# EAGLE design timelapse (EAGLE 8.6.0)
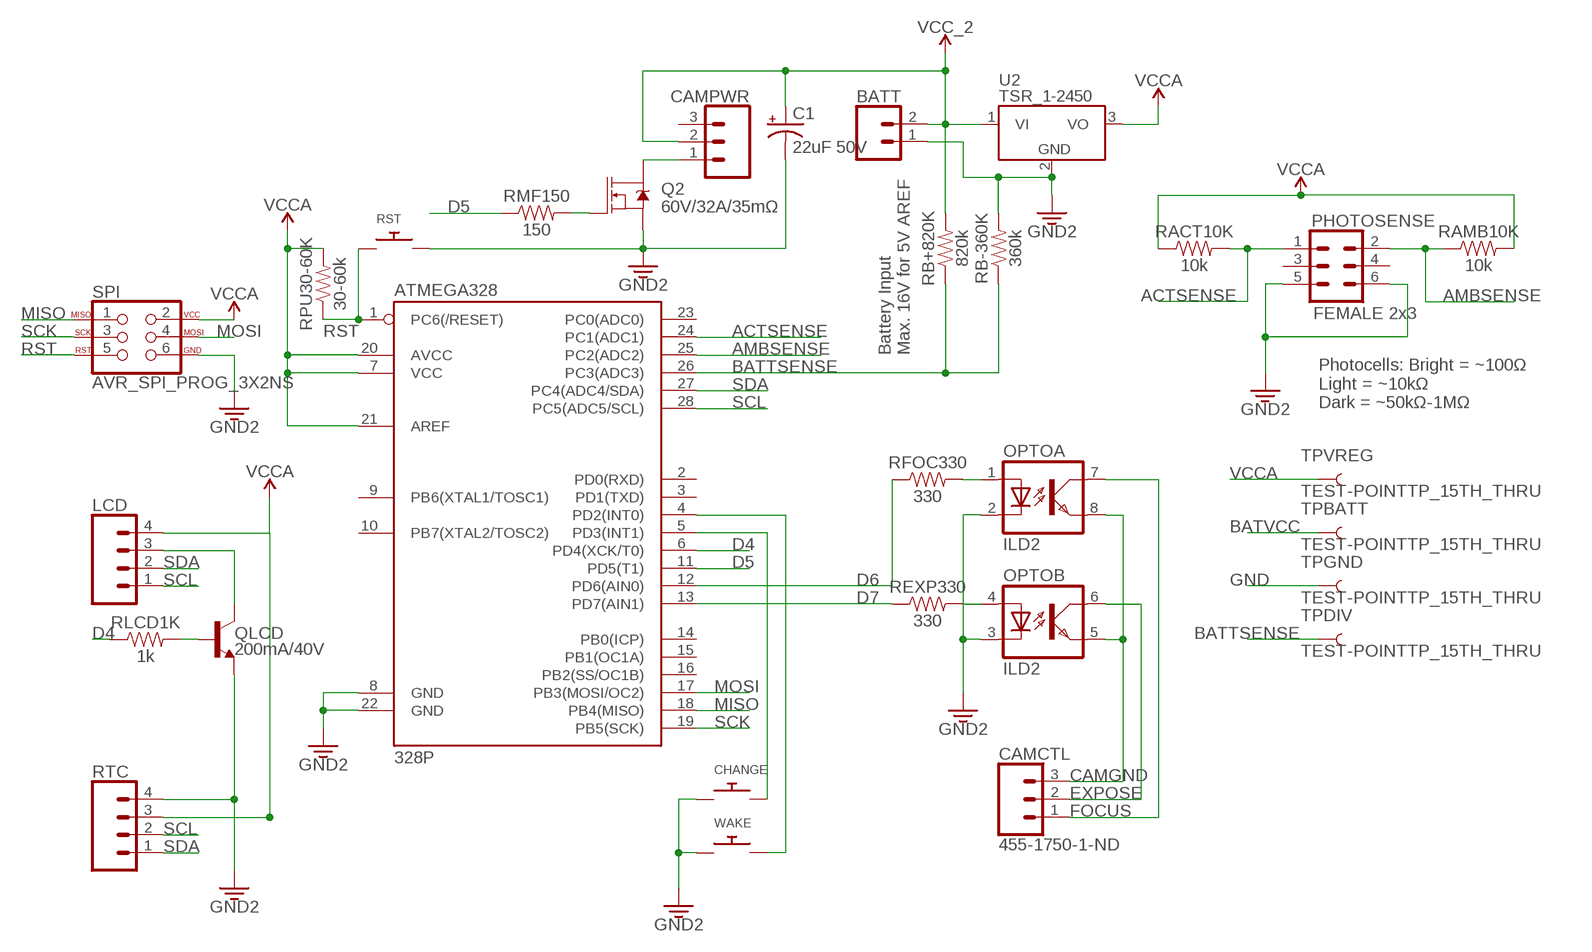
[diagram p0: schematic, sheet 1]

## Parts
ATMEGA328  328P  ATMEGA328P_PDIP  [DIP28]
BATT  CONN_02  [1X02]
C1  22uF 50V  10UF-POLAR-RADIAL-2.5MM-25V-20%  [CPOL-RADIAL-2.5MM-5MM]
CAMCTL  455-1750-1-ND  CONN_03  [1X03]
CAMPWR  CONN_03  [1X03]
CHANGE  SWITCH_PUSHBUTTONEVQ-PE  [TACT_PANA-EVQ]
LCD  CONN_04  [1X04]
OPTO  ILD2  [DIL08]
PHOTOSENSE  FEMALE 2x3  CONN_03X2FEMALE  [2X3]
Q2  60V/32A/35mΩ  MOSFET-NCH-FQP30N06L  [TO220V]
QLCD  200mA/40V  TRANS_NPN-2N3904  [TO-92]
RACT10K  10k  10KOHM-HORIZ-1/4W-1%  [AXIAL-0.3]
RAMB10K  10k  10KOHM-HORIZ-1/4W-1%  [AXIAL-0.3]
RB+820K  820k  10KOHM-HORIZ-1/4W-1%  [AXIAL-0.3]
RB-360K  360k  10KOHM-HORIZ-1/4W-1%  [AXIAL-0.3]
REXP330  330  330OHM-HORIZ-1/10W-5%  [AXIAL-0.3]
RFOC330  330  330OHM-HORIZ-1/10W-5%  [AXIAL-0.3]
RLCD1K  1k  330OHM-HORIZ-1/10W-5%  [AXIAL-0.3]
RMF150  150  330OHM-HORIZ-1/10W-5%  [AXIAL-0.3]
RPU30-60K  30-60k  330OHM-HORIZ-1/10W-5%  [AXIAL-0.3]
RST  SWITCH_PUSHBUTTONEVQ-PE  [TACT_PANA-EVQ]
RTC  CONN_04  [1X04]
SPI  AVR_SPI_PROG_3X2NS  [2X3-NS]
TPBATT  TEST-POINTTP_15TH_THRU  [TP_15TH]
TPDIV  TEST-POINTTP_15TH_THRU  [TP_15TH]
TPGND  TEST-POINTTP_15TH_THRU  [TP_15TH]
TPVREG  TEST-POINTTP_15TH_THRU  [TP_15TH]
U2  TSR_1-2450  [TSR-1]
WAKE  SWITCH_PUSHBUTTONEVQ-PE  [TACT_PANA-EVQ]

## Nets
ACTSENSE: ATMEGA328.24(PC1(ADC1)) PHOTOSENSE.1 RACT10K.P$2
AMBSENSE: ATMEGA328.25(PC2(ADC2)) PHOTOSENSE.2 RAMB10K.P$1
BATTSENSE: ATMEGA328.26(PC3(ADC3)) RB+820K.P$1 RB-360K.P$1 TPDIV.P$1
BATVCC [power]: BATT.2 C1.1(+) CAMPWR.2 RB+820K.P$2 TPBATT.P$1 U2.1(VI) ; supply symbol labelled VCC_2
CAMGND: CAMCTL.3 OPTO.5(B:EMIT) OPTO.8(A:EMIT)
D4: ATMEGA328.6(PD4(XCK/T0)) RLCD1K.P$1
D5: ATMEGA328.11(PD5(T1)) RMF150.P$1
D6: ATMEGA328.12(PD6(AIN0)) RFOC330.P$1
D7: ATMEGA328.13(PD7(AIN1)) REXP330.P$1
EXPOSE: CAMCTL.2 OPTO.6(B:COL)
FOCUS: CAMCTL.1 OPTO.7(A:COL)
GND [power]: ATMEGA328.8(GND) ATMEGA328.22(GND) BATT.1 C1.2(-) CHANGE.P$1 OPTO.2(A:C) OPTO.3(B:C) PHOTOSENSE.5 PHOTOSENSE.6 Q2.3(S) QLCD.1(E) RB-360K.P$2 RST.P$2 RTC.4 SPI.6 TPGND.P$1 U2.2(GND) WAKE.P$1 ; supply symbol labelled GND2
MISO: ATMEGA328.18(PB4(MISO)) SPI.1
MOSI: ATMEGA328.17(PB3(MOSI/OC2)) SPI.4
N$1: OPTO.1(A:A) RFOC330.P$2
N$2: OPTO.4(B:A) REXP330.P$2
N$3: QLCD.2(B) RLCD1K.P$2
N$5 [power]: LCD.3 QLCD.3(C)
N$6: Q2.1(G) RMF150.P$2
N$7: ATMEGA328.5(PD3(INT1)) CHANGE.P$2
N$8: ATMEGA328.4(PD2(INT0)) WAKE.P$2
N$9 [power]: CAMPWR.1 Q2.2(D)
RST: ATMEGA328.1(PC6(/RESET)) RPU30-60K.P$1 RST.P$1 SPI.5
SCK: ATMEGA328.19(PB5(SCK)) SPI.3
SCL: ATMEGA328.28(PC5(ADC5/SCL)) LCD.1 RTC.2
SDA: ATMEGA328.27(PC4(ADC4/SDA)) LCD.2 RTC.1
VCCA [power]: ATMEGA328.7(VCC) ATMEGA328.20(AVCC) ATMEGA328.21(AREF) LCD.4 RACT10K.P$1 RAMB10K.P$2 RPU30-60K.P$2 RTC.3 SPI.2 TPVREG.P$1 U2.3(VO)
Unconnected: ATMEGA328.2(PD0(RXD)) ATMEGA328.3(PD1(TXD)) ATMEGA328.9(PB6(XTAL1/TOSC1)) ATMEGA328.10(PB7(XTAL2/TOSC2)) ATMEGA328.14(PB0(ICP)) ATMEGA328.15(PB1(OC1A)) ATMEGA328.16(PB2(SS/OC1B)) ATMEGA328.23(PC0(ADC0)) CAMPWR.3 PHOTOSENSE.3 PHOTOSENSE.4

## Notes on the sheet
- Battery Input
  Max. 16V for 5V AREF
- Photocells: Bright = ~100Ω
  Light = ~10kΩ
  Dark = ~50kΩ-1MΩ

## Library data of the parts
ATMEGA328 = SparkFun-IC-Microcontroller:ATMEGA328P_PDIP: Atmel 328P Through hole ATMEGA328P uC used in the Arduino 32kb flash, 1k EEPROM, 2k SRAM Datasheet <http://www.sparkfun.com/datasheets/Components/SMD/ATMega328.pdf> SparkFun Products Storefront component: AVR 28 Pin 20MHz 32K 6A/D - ATMega328P <https://www.sparkfun.com/products/9061> (COM-09061) SparkFun Simon Says - Through-Hole Soldering Kit <https://www.sparkfun.com/products/10547> (KIT-10547) SparkFun Learn to Solder - Simon Says <https://www.sparkfun.com/products/13708> (KIT-13708) SparkFun BigTime Watch Kit <https://www.sparkfun.com/products/11734> (KIT-11734) SparkFun ClockIt <https://www.sparkfun.com/products/10930> (KIT-10930) SparkFun Serial Enabled LCD Kit <https://www.sparkfun.com/products/10097> (LCD-10097) SparkFun Simon Tilts - Through Hole Soldering Kit <https://www.sparkfun.com/products/12634> (KIT-12634) SparkFun Frequency Counter Kit <https://www.sparkfun.com/products/10140> (KIT-10140) FabFM Radio Kit <https://www.sparkfun.com/products/11043> (KIT-11043) SparkFun Binary Blaster Kit <https://www.sparkfun.com/products/12037> (KIT-12037) SparkFun Metro-Gnome <https://www.sparkfun.com/products/9236> (KIT-09236) ATmega328 with Arduino Optiboot (Uno) <https://www.sparkfun.com/products/10524> (DEV-10524); PROD_ID: IC-09136
BATT = SparkFun-Connectors:CONN_02: Multi connection point. Often used as Generic Header-pin footprint for 0.1 inch spaced/style header connections On any of the 0.1 inch spaced packages, you can populate with these: Break Away Headers - Straight <https://www.sparkfun.com/products/116> (PRT-00116) Break Away Male Headers - Right Angle <https://www.sparkfun.com/products/553> (PRT-00553) Female Headers <https://www.sparkfun.com/products/115> (PRT-00115) Break Away Headers - Machine Pin <https://www.sparkfun.com/products/117> (PRT-00117) Break Away Female Headers - Swiss Machine Pin <https://www.sparkfun.com/products/743> (PRT-00743) For SCREWTERMINALS and SPRING TERMINALS visit here: Screw Terimnals on SparkFun.com <https://www.sparkfun.com/search/results?term=Screw+Terminals> (5mm/3.5mm/2.54mm spacing) This device is also useful as a general connection point to wire up your design to another part of your project. Our various solder wires solder well into these plated through hole pads. Hook-Up Wire - Assortment (Stranded, 22 AWG) <https://www.sparkfun.com/products/11375> (PRT-11375) Hook-Up Wire - Assortment (Solid Core, 22 AWG) <https://www.sparkfun.com/products/11367> (PRT-11367) View the entire wire category on our website here <https://www.sparkfun.com/categories/141> Special notes: Molex polarized connector foot print use with: PRT-08233 with associated crimp pins and housings. 2.54_SCREWTERM for use with PRT-10571. 3.5mm Screw Terminal footprints for PRT-08084 5mm Screw Terminal footprints for use with PRT-08432
C1 = SparkFun-Capacitors:10UF-POLAR: 10.0µF polarized capacitors A capacitor is a passive two-terminal electrical component used to store electrical energy temporarily in an electric field.; PROD_ID: CAP-08440; VALUE: 10uF
CAMCTL = SparkFun-Connectors:CONN_03: Multi connection point. Often used as Generic Header-pin footprint for 0.1 inch spaced/style header connections On any of the 0.1 inch spaced packages, you can populate with these: Break Away Headers - Straight <https://www.sparkfun.com/products/116> (PRT-00116) Break Away Male Headers - Right Angle <https://www.sparkfun.com/products/553> (PRT-00553) Female Headers <https://www.sparkfun.com/products/115> (PRT-00115) Break Away Headers - Machine Pin <https://www.sparkfun.com/products/117> (PRT-00117) Break Away Female Headers - Swiss Machine Pin <https://www.sparkfun.com/products/743> (PRT-00743) Stackable Header - 3 Pin (Female, 0.1") <https://www.sparkfun.com/products/13875> (PRT-13875) For SCREWTERMINALS and SPRING TERMINALS visit here: Screw Terimnals on SparkFun.com <https://www.sparkfun.com/search/results?term=Screw+Terminals> (5mm/3.5mm/2.54mm spacing) This device is also useful as a general connection point to wire up your design to another part of your project. Our various solder wires solder well into these plated through hole pads. Hook-Up Wire - Assortment (Stranded, 22 AWG) <https://www.sparkfun.com/products/11375> (PRT-11375) Hook-Up Wire - Assortment (Solid Core, 22 AWG) <https://www.sparkfun.com/products/11367> (PRT-11367) View the entire wire category on our website here <https://www.sparkfun.com/categories/141> Special notes: Molex polarized connector foot print use with SKU : PRT-08232 with associated crimp pins and housings.; PROD_ID: XXX-00000
CAMPWR = SparkFun-Connectors:CONN_03: Multi connection point. Often used as Generic Header-pin footprint for 0.1 inch spaced/style header connections On any of the 0.1 inch spaced packages, you can populate with these: Break Away Headers - Straight <https://www.sparkfun.com/products/116> (PRT-00116) Break Away Male Headers - Right Angle <https://www.sparkfun.com/products/553> (PRT-00553) Female Headers <https://www.sparkfun.com/products/115> (PRT-00115) Break Away Headers - Machine Pin <https://www.sparkfun.com/products/117> (PRT-00117) Break Away Female Headers - Swiss Machine Pin <https://www.sparkfun.com/products/743> (PRT-00743) Stackable Header - 3 Pin (Female, 0.1") <https://www.sparkfun.com/products/13875> (PRT-13875) For SCREWTERMINALS and SPRING TERMINALS visit here: Screw Terimnals on SparkFun.com <https://www.sparkfun.com/search/results?term=Screw+Terminals> (5mm/3.5mm/2.54mm spacing) This device is also useful as a general connection point to wire up your design to another part of your project. Our various solder wires solder well into these plated through hole pads. Hook-Up Wire - Assortment (Stranded, 22 AWG) <https://www.sparkfun.com/products/11375> (PRT-11375) Hook-Up Wire - Assortment (Solid Core, 22 AWG) <https://www.sparkfun.com/products/11367> (PRT-11367) View the entire wire category on our website here <https://www.sparkfun.com/categories/141> Special notes: Molex polarized connector foot print use with SKU : PRT-08232 with associated crimp pins and housings.; PROD_ID: XXX-00000; VALUE: 455-1750-1-ND
CHANGE RST WAKE = adafruit:SWITCH_PUSHBUTTON: Buttons SOFTTOUCHSMD_SJ - Soft touch temporary push button (Super Junk Akihabara) Compatible with SKPMANE010 [Mouser: 688-SKPMAN] C&K_KSS = Digikey: KSS221GLFS
LCD RTC = SparkFun-Connectors:CONN_04: Multi connection point. Often used as Generic Header-pin footprint for 0.1 inch spaced/style header connections On any of the 0.1 inch spaced packages, you can populate with these: Break Away Headers - Straight <https://www.sparkfun.com/products/116> (PRT-00116) Break Away Male Headers - Right Angle <https://www.sparkfun.com/products/553> (PRT-00553) Female Headers <https://www.sparkfun.com/products/115> (PRT-00115) Break Away Headers - Machine Pin <https://www.sparkfun.com/products/117> (PRT-00117) Break Away Female Headers - Swiss Machine Pin <https://www.sparkfun.com/products/743> (PRT-00743) For SCREWTERMINALS and SPRING TERMINALS visit here: Screw Terimnals on SparkFun.com <https://www.sparkfun.com/search/results?term=Screw+Terminals> (5mm/3.5mm/2.54mm spacing) This device is also useful as a general connection point to wire up your design to another part of your project. Our various solder wires solder well into these plated through hole pads. Hook-Up Wire - Assortment (Stranded, 22 AWG) <https://www.sparkfun.com/products/11375> (PRT-11375) Hook-Up Wire - Assortment (Solid Core, 22 AWG) <https://www.sparkfun.com/products/11367> (PRT-11367) View the entire wire category on our website here <https://www.sparkfun.com/categories/141> Special notes: Molex polarized connector foot print use with SKU : PRT-08231 with associated crimp pins and housings. 1MM SMD Version SKU: PRT-10208; PROD_ID: CONN-09696
OPTO = optocoupler-2:ILD2: SIEMENS OPTO COUPLER
PHOTOSENSE = SparkFun-Connectors:CONN_03X2: Multi connection point. Often used as Generic Header-pin footprint for 0.1 inch spaced/style header connections You can populate with any combo of single row headers, but if you'd like an exact match, check these: Header - 2x3 (Male, 0.1") <https://www.sparkfun.com/products/12807> (PRT-12807) Header - 2x3 (Female, 0.1") <https://www.sparkfun.com/products/13010> (PRT-13010) 2x3 Pin Shrouded Header <https://www.sparkfun.com/products/10877> (PRT-10877) On any of the 0.1 inch spaced packages, you can populate with these: Break Away Headers - Straight <https://www.sparkfun.com/products/116> (PRT-00116) Break Away Male Headers - Right Angle <https://www.sparkfun.com/products/553> (PRT-00553) Female Headers <https://www.sparkfun.com/products/115> (PRT-00115) Break Away Headers - Machine Pin <https://www.sparkfun.com/products/117> (PRT-00117) Break Away Female Headers - Swiss Machine Pin <https://www.sparkfun.com/products/743> (PRT-00743) Special note: the shrouded connector mates well with our 3x2 ribbon cables: Ribbon Crimp Connector - 6-pin (2x3, Female) <https://www.sparkfun.com/products/10651> (PRT-10651) Ribbon Cable - 6 wire (15ft) <https://www.sparkfun.com/products/10646> (PRT-10646); PROD_ID: CONN-11566
Q2 = SparkFun-DiscreteSemi:MOSFET-NCH: N-channel MOSFETs Voltage controlled devices that allow control of high current outputs. SparkFun Products: SparkFun OpenScale <https://www.sparkfun.com/products/13261> SparkFun Digital Sandbox <https://www.sparkfun.com/products/12651> SparkFun Monster Moto Shield <https://www.sparkfun.com/products/10182> SparkFun MOSFET Power Controller <https://www.sparkfun.com/products/11214>; PROD_ID: TRANS-10060
QLCD = SparkFun-DiscreteSemi:TRANS_NPN: NPN transistor Current controlled devices typically used to amplify current or used as a switch. BC547 - COM-08928 <http://www.sparkfun.com/products/8928> (TO-92 45V 100mA) (1.Collector 2.Base 3.Emitter) 2N3904 - COM-00521 <http://www.sparkfun.com/products/521> (TO-92 40V 200mA) (1.Emitter 2.Base 3.Collector) P2N2222A - COM-12852 <http://www.sparkfun.com/products/12852> (TO-92 40V 600mA) (1.Collector 2.Base 3.Emitter); PROD_ID: TRANS-08447
RACT10K RAMB10K = SparkFun-Resistors:10KOHM: 10kΩ resistor A resistor is a passive two-terminal electrical component that implements electrical resistance as a circuit element. Resistors act to reduce current flow, and, at the same time, act to lower voltage levels within circuits. - Wikipedia; PROD_ID: RES-12183
RB+820K RB-360K = SparkFun-Resistors:10KOHM: 10kΩ resistor A resistor is a passive two-terminal electrical component that implements electrical resistance as a circuit element. Resistors act to reduce current flow, and, at the same time, act to lower voltage levels within circuits. - Wikipedia; PROD_ID: RES-12183; VALUE: 10k
REXP330 RFOC330 = SparkFun-Resistors:330OHM: 330Ω resistor A resistor is a passive two-terminal electrical component that implements electrical resistance as a circuit element. Resistors act to reduce current flow, and, at the same time, act to lower voltage levels within circuits. - Wikipedia; PROD_ID: RES-8371
RLCD1K RMF150 RPU30-60K = SparkFun-Resistors:330OHM: 330Ω resistor A resistor is a passive two-terminal electrical component that implements electrical resistance as a circuit element. Resistors act to reduce current flow, and, at the same time, act to lower voltage levels within circuits. - Wikipedia; PROD_ID: RES-8371; VALUE: 330
SPI = SparkFun-Connectors:AVR_SPI_PROG_3X2: AVR ISP 6 Pin This is the reduced ISP connector for AVR programming. Common on Arduino. This footprint will take up less PCB space and can be used with a 10-pin to 6-pin adapter such as SKU: BOB-08508 **Special note about "TEST_POINT" package. The stop mask is on the top side, so if you want your programming test points to be on the bottom of your board, make sure to place this package on the bottom side of the board. This also ensure that the orientation to program from the bottom side will be correct. SparkFun Products: SparkFun ISP Pogo Adapter <https://www.sparkfun.com/products/11591> - NS Tiny AVR Programmer <https://www.sparkfun.com/products/11801> -PTH
TPBATT TPDIV TPGND TPVREG = SparkFun-Connectors:TEST-POINT: SparkFun Test Points Bare copper test points for troubleshooting or In-Circuit-Testing. These are used by our Production team for verifying production board runs using pogo-pins on test beds. SparkFun Products: SparkFun LSM9DS1 Breakout <https://www.sparkfun.com/products/13284> SparkFun PSOC <https://www.sparkfun.com/products/13714> SparkFun Load Cell Amplifier <https://www.sparkfun.com/products/13879>
U2 = _traco_tsr-1:TSR_1-*: TRACO TSR-1 Series Point-of-Load DC/DC-Converters Vi max. 36 V; Vo = (1.2 .. 15)V ±2%; Io = 0 .. 1 A SIP-Package (drop-in replacement for 78xx linear voltage regulators in TO220-package, vertically assembled) Source: www.tracopower.com Technologies: TSR 1- Vi (V) Vo (V) ±2% Io = 0 .. 1 A 24_ ( generic ) 2412 4.6 .. 36 1.2 2415 4.6 .. 36 1.5 2418 4.6 .. 36 1.8 2425 4.6 .. 36 2.5 2433 4.75.. 36 3.3 2450 6.5 .. 36 5.0 2465 9.0 .. 36 6.5 2490 12 .. 36 9.0 24120 15 .. 36 12 24150 18 .. 36 15 Author: Dipl.-Ing. FH Rainer Bayer HHN Hochschule Heilbronn, rainer.bayer@hs-heilbronn.de Ingenieurbüro ing-rb, mail@ing-rb.de

## Net classes
1 power: width 0.406 mm

## Board
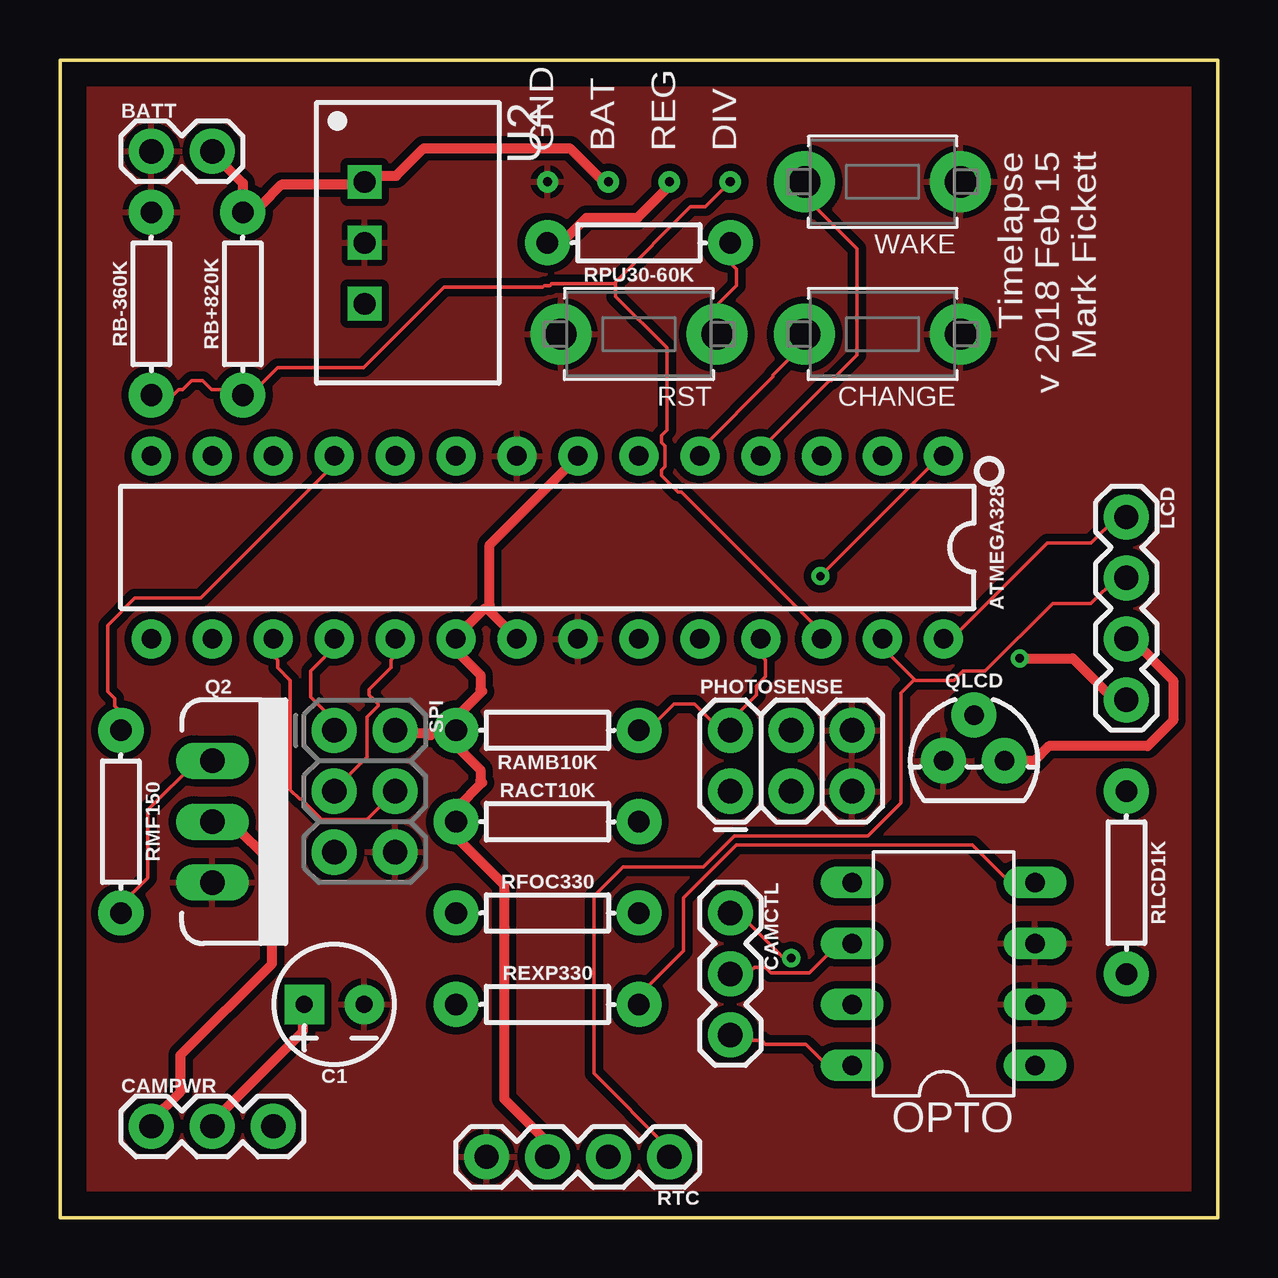
[diagram p1: board, top side]
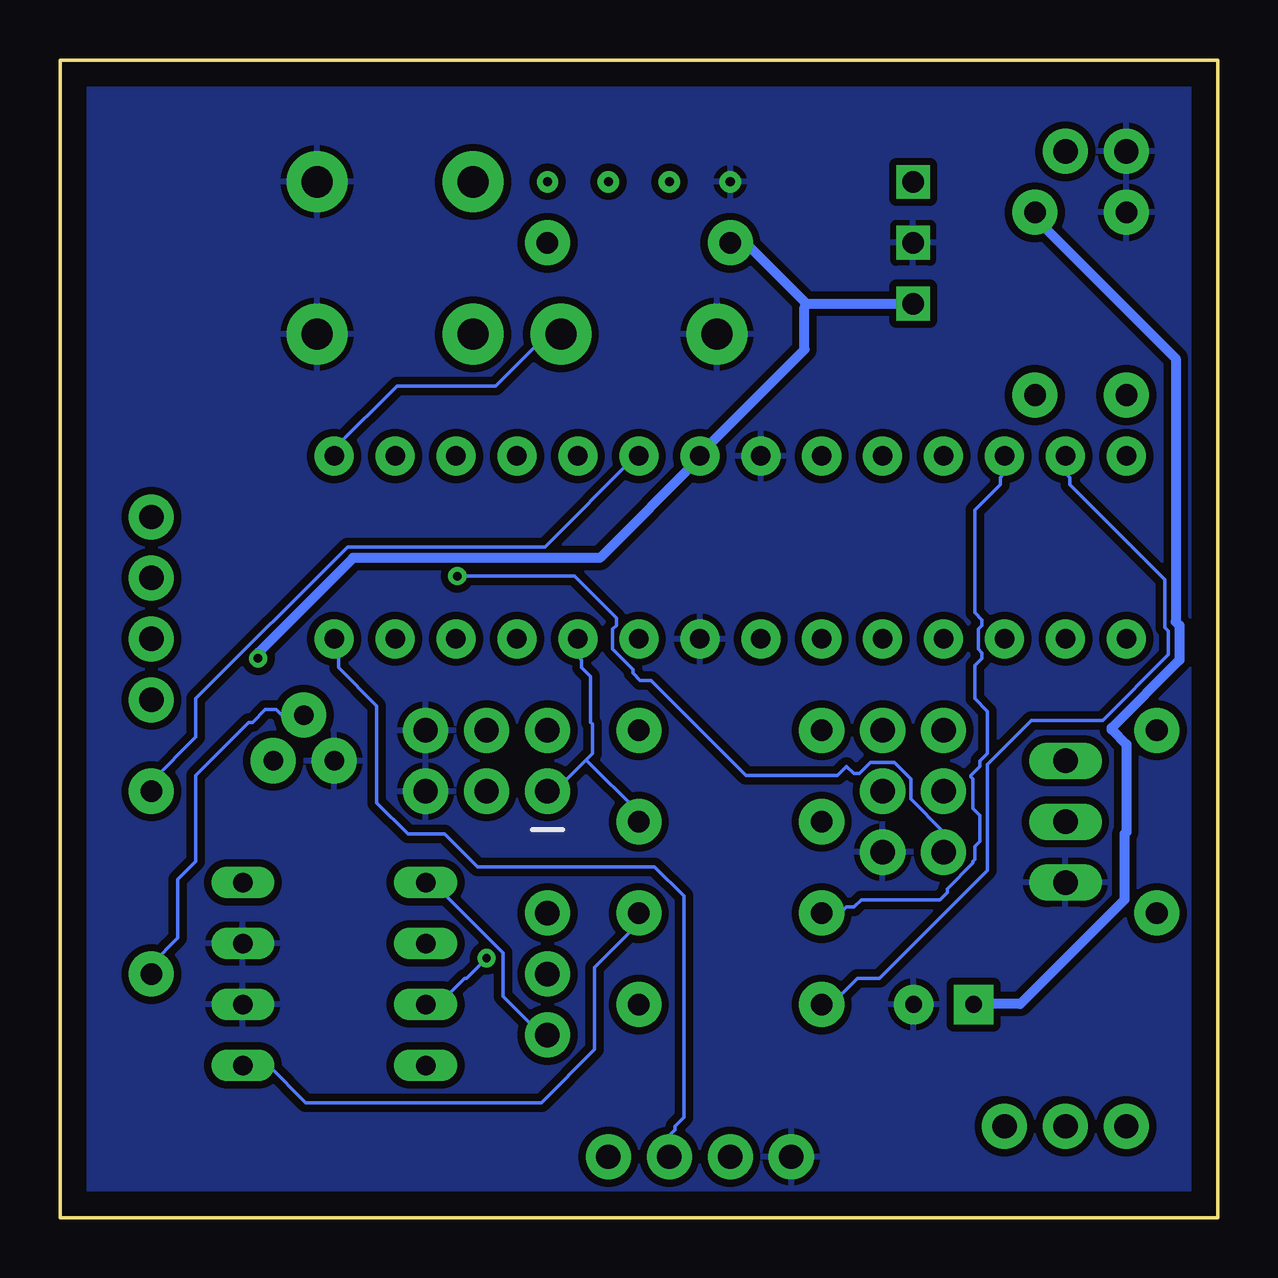
[diagram p2: board, bottom side, seen from below]

Size 48.26 x 48.26 mm. Coordinates in mm from the lower left corner, seen from the top.
Outline: 0,0 0,48.26 48.26,48.26 48.26,0 0,0
Copper layers (1*16): Top 0.035mm / dielectric 1.5mm / Bottom 0.035mm
Design rules "default": minimum track width 6mil, minimum drill 0.35mm, track to track 6mil, track to pad 6mil, pad to pad 6mil, via to via 6mil, smd to smd 6mil, copper to edge 40mil, drill to drill 6mil, minimum pad ring 10mil, minimum via ring 8mil, stop-mask expansion 4mil, vias tented up to drill 0mil, thermal gap 10mil

### Footprints (pad centres in the part's own frame; a part is rotated, then mirrored left to right if it is on the bottom)
DIP28 = drill 0.813 pad 1.626: 1 -16.51,-3.81; 2 -13.97,-3.81; 3 -11.43,-3.81; 4 -8.89,-3.81; 5 -6.35,-3.81; 6 -3.81,-3.81; 7 -1.27,-3.81; 8 1.27,-3.81; 9 3.81,-3.81; 10 6.35,-3.81; 11 8.89,-3.81; 12 11.43,-3.81; 13 13.97,-3.81; 14 16.51,-3.81; 15 16.51,3.81; 16 13.97,3.81; 17 11.43,3.81; 18 8.89,3.81; 19 6.35,3.81; 20 3.81,3.81; 21 1.27,3.81; 22 -1.27,3.81; 23 -3.81,3.81; 24 -6.35,3.81; 25 -8.89,3.81; 26 -11.43,3.81; 27 -13.97,3.81; 28 -16.51,3.81
1X02 = drill 1.016 pad 1.88: 1 0,0; 2 2.54,0
CPOL-RADIAL-2.5MM-5MM = drill 0.7 pad 1.651 square: 1 1.25,0 | drill 0.7 pad 1.651: 2 -1.25,0
1X03 = drill 1.016 pad 1.88: 1 0,0; 2 2.54,0; 3 5.08,0
TACT_PANA-EVQ = drill 1.3 pad 2.54: P$1 -3.25,0; P$2 3.25,0
1X04 = drill 1.016 pad 1.88: 1 0,0; 2 2.54,0; 3 5.08,0; 4 7.62,0
DIL08 = drill 0.813 long: 1 -3.81,-3.81; 2 -1.27,-3.81; 3 1.27,-3.81; 4 3.81,-3.81; 5 3.81,3.81; 6 1.27,3.81; 7 -1.27,3.81; 8 -3.81,3.81
2X3 = drill 1.016 pad 1.88: 1 0,0; 2 0,2.54; 3 2.54,0; 4 2.54,2.54; 5 5.08,0; 6 5.08,2.54
TO220V = drill 1.016 long: 1 -2.54,0; 2 0,0; 3 2.54,0
TO-92 = drill 0.813 pad 1.88: 1 -1.27,0; 2 0,1.905; 3 1.27,0
AXIAL-0.3 = drill 0.9 pad 1.88: P$1 -3.81,0; P$2 3.81,0
2X3-NS = drill 1.016 pad 1.88: 1 -2.54,-1.27; 2 -2.54,1.27; 3 0,-1.27; 4 0,1.27; 5 2.54,-1.27; 6 2.54,1.27
TP_15TH = drill 0.381 pad 0.61: P$1 0,0
TSR-1 = drill 0.9 square: 1 -2.54,0; 2 0,0; 3 2.54,0

### Placement (x,y rotation side)
ATMEGA328  20.32,27.94 180 top
BATT  3.81,44.45 0 top
C1  11.43,8.89 180 top
CAMCTL  27.94,12.7 270 top
CAMPWR  3.81,3.81 0 top
CHANGE  34.29,36.83 180 top
LCD  44.45,29.21 270 top
OPTO  36.83,10.16 90 top
PHOTOSENSE  27.94,17.78 0 top
Q2  6.35,16.51 270 top
QLCD  38.1,19.05 0 top
RACT10K  20.32,16.51 0 top
RAMB10K  20.32,20.32 180 top
RB+820K  7.62,38.1 90 top
RB-360K  3.81,38.1 90 top
REXP330  20.32,8.89 0 top
RFOC330  20.32,12.7 0 top
RLCD1K  44.45,13.97 270 top
RMF150  2.54,16.51 270 top
RPU30-60K  24.13,40.64 180 top
RST  24.13,36.83 180 top
RTC  25.4,2.54 180 top
SPI  12.7,17.78 270 top
TPBATT  22.86,43.18 0 top
TPDIV  27.94,43.18 0 top
TPGND  20.32,43.18 0 top
TPVREG  25.4,43.18 0 top
U2  12.7,40.64 270 top
WAKE  34.29,43.18 180 top

### Tracks (layer width: path | path; a pad name or v marks a point on that pad's centre or on a via)
ACTSENSE
  Bottom 0.152: ATMEGA328.24 26.67,23.39 26.52,23.24 26.52,22.94 26.14,22.55 26.14,20.65 26.06,20.57 26.06,19.36 26.33,19.09 | 26.33,19.09 27.58,17.83 27.89,17.83 PHOTOSENSE.1 | 26.33,19.09 24.16,16.92 24.16,16.54 RACT10K.P$2
AMBSENSE
  Top 0.152: 27.96,20.73 29.03,21.79 29.03,22.17 29.41,22.55 29.41,23.24 29.26,23.39 29.26,24.08 ATMEGA328.25 | 27.96,20.73 27.96,20.34 PHOTOSENSE.2 27.96,20.73 | 27.96,20.73 27.13,20.73 26.44,21.41 25.6,21.41 24.54,20.34 24.16,20.34 RAMB10K.P$1
BATTSENSE
  Top 0.152: TPDIV.P$1 26.9,42.14 26.29,42.14 23.13,38.98 | 23.13,38.98 23.09,38.94 20.5,38.94 20.42,38.86 20.19,38.86 20.12,38.79 16,38.79 12.65,35.43 9.07,35.43 7.92,34.29 RB+820K.P$1 7.39,34.52 6.33,34.52 5.94,34.9 5.49,34.9 5.11,34.52 4.95,34.52 4.72,34.29 RB-360K.P$1 | ATMEGA328.26 31.7,24.16 31.7,24.46 25.91,30.25 25.76,30.25 25.07,30.94 25.07,31.17 25.22,31.32 25.22,32.16 25.07,32.31 25.07,32.61 25.3,32.84 25.3,36.27 23.16,38.41 23.16,38.94 23.13,38.98
BATVCC
  Top 0.406: C1.1 10.13,8.84 10.13,7.77 6.4,4.04 6.4,3.81 CAMPWR.2 | BATT.2 6.33,44.42 7.62,43.13 RB+820K.P$2 7.77,42.22 8.38,42.22 9.22,43.05 12.57,43.05 U2.1 12.95,43.43 14.02,43.43 15.16,44.58 21.26,44.58 22.63,43.2 22.86,43.2 TPBATT.P$1
  Bottom 0.406: RB+820K.P$2 7.62,41.68 1.75,35.81 1.75,24.84 1.6,24.69 1.6,23.24 4.42,20.42 4.42,20.34 3.81,19.74 3.81,16.08 3.89,16 3.89,13.26 8.23,8.91 10.13,8.91 C1.1
CAMGND
  Top 0.152: CAMCTL.3 28.65,7.62 28.88,7.39 29.26,7.39 29.41,7.24 31.09,7.24 31.93,6.4 32.99,6.4 OPTO.8
  Bottom 0.152: CAMCTL.3 28.19,7.62 29.79,9.22 29.79,11.05 32.69,13.95 32.99,13.95 OPTO.5
D4
  Bottom 0.152: ATMEGA328.6 24.16,31.7 24.31,31.7 28.04,27.96 36.27,27.96 42.6,21.64 42.6,20.04 44.42,18.21 44.42,17.83 RLCD1K.P$1
D5
  Top 0.152: ATMEGA328.11 11.43,31.39 5.87,25.83 3.12,25.83 1.98,24.69 1.98,21.95 2.29,21.64 2.29,21.34 2.52,21.11 2.52,20.34 RMF150.P$1
D6
  Bottom 0.152: ATMEGA328.12 8.91,31.7 8.91,31.01 9.07,30.86 9.07,30.56 10.13,29.49 10.13,25.22 9.83,24.92 9.83,24.69 9.98,24.54 9.98,23.7 9.83,23.55 9.83,23.32 10.13,23.01 10.13,21.64 9.6,21.11 9.6,19.36 9.91,19.05 9.91,18.82 10.29,18.44 10.29,18.36 10.21,18.29 10.21,17.07 9.91,16.76 9.91,15.7 10.13,15.47 10.13,14.94 10.21,14.86 10.21,14.78 11.28,13.72 11.28,13.56 11.58,13.26 14.86,13.26 15.16,12.95 15.47,12.95 15.7,12.72 16.46,12.72 RFOC330.P$1
D7
  Bottom 0.152: ATMEGA328.13 6.33,31.7 6.33,31.01 6.17,30.86 6.17,30.56 2.21,26.59 2.21,24.61 2.06,24.46 2.06,23.47 4.8,20.73 7.77,20.73 9.6,18.9 9.6,14.48 14.1,9.98 15.01,9.98 16.08,8.91 16.46,8.91 REXP330.P$1
EXPOSE
  Top 0.152: OPTO.6 32.46,11.43 31.24,10.21 29.64,10.21 29.41,10.44 28.96,10.44 28.73,10.21 27.96,10.21 CAMCTL.2
FOCUS  (via drill 0.35)
  Top 0.152: v30.48,10.82 30.18,10.82 28.35,12.65 27.96,12.65 CAMCTL.1
  Bottom 0.152: v30.48,10.82 31.32,9.98 31.39,9.98 32.46,8.91 32.99,8.91 OPTO.7
GND
  pour Top (isolate 0.305): 0,48.26 48.26,48.26 48.26,0 0,0
  pour Bottom (isolate 0.305): 0,0 0,48.26 48.26,48.26 48.26,0
MISO
  Top 0.152: ATMEGA328.18 11.43,23.77 10.44,22.78 10.44,21.72 11.43,20.73 SPI.1
MOSI
  Top 0.152: SPI.4 12.8,16.61 10.9,16.61 10.06,17.45 9.98,17.45 9.6,17.83 9.6,22.4 9.07,22.94 9.07,23.24 8.91,23.39 8.91,24.08 ATMEGA328.17
N$1
  Bottom 0.152: OPTO.1 40.62,6.33 39.55,6.33 38.02,4.8 28.19,4.8 25.98,7.01 25.98,10.44 24.16,12.27 24.16,12.65 RFOC330.P$2
N$2
  Top 0.152: OPTO.4 40.62,14.02 39.55,14.02 38.02,15.54 28.19,15.54 25.98,13.34 25.98,11.12 24.16,9.3 24.16,8.91 REXP330.P$2
N$3
  Bottom 0.152: QLCD.2 39.01,20.95 39.24,21.18 39.7,21.18 40.23,20.65 40.39,20.65 42.6,18.44 42.6,14.86 43.36,14.1 43.36,11.66 44.42,10.59 44.42,10.21 RLCD1K.P$2
N$5
  Top 0.406: QLCD.3 40.62,19.05 41.22,19.66 45.34,19.66 46.41,20.73 46.41,22.4 44.73,24.08 44.5,24.08 LCD.3
N$6
  Top 0.152: Q2.1 5.71,19.05 3.66,16.99 3.66,14.17 2.59,13.11 2.59,12.72 RMF150.P$2
N$7
  Top 0.152: ATMEGA328.5 26.67,32 29.72,35.05 29.72,35.13 31.01,36.42 31.01,36.8 CHANGE.P$2
N$8
  Top 0.152: ATMEGA328.4 29.26,31.77 29.26,32.08 32.08,34.9 32.16,34.9 33.22,35.97 33.22,40.39 31.09,42.52 31.09,43.13 WAKE.P$2
N$9
  Top 0.406: CAMPWR.1 3.81,4.04 5.03,5.26 5.03,6.78 8.84,10.59 8.84,14.78 7.16,16.46 6.4,16.46 Q2.2
RST  (via drill 0.35)
  Top 0.152: v31.7,26.75 36.65,31.7 36.8,31.7 ATMEGA328.1 | RPU30-60K.P$1 27.96,40.62 27.96,39.78 28.19,39.55 28.19,38.86 27.36,38.02 27.36,36.88 RST.P$1
  Bottom 0.152: ATMEGA328.1 36.8,31.77 36.8,32.08 34.21,34.67 30.1,34.67 27.96,36.8 27.43,36.8 RST.P$1 | SPI.5 11.43,16.08 12.8,17.45 12.8,18.29 13.49,18.97 14.48,18.97 14.94,18.52 15.16,18.52 15.47,18.82 15.85,18.44 19.66,18.44 23.62,22.4 24.08,22.4 24.38,22.71 24.38,22.86 25.22,23.7 25.22,24.54 25.07,24.69 25.07,24.99 26.82,26.75 v31.7,26.75
SCK
  Top 0.152: ATMEGA328.19 13.95,24.08 13.95,23.39 13.79,23.24 13.79,22.94 12.88,22.02 12.88,21.79 13.26,21.41 13.26,21.34 12.8,20.88 12.8,19.2 11.43,17.83 SPI.3
SCL
  Top 0.152: ATMEGA328.28 36.88,24.16 37.19,24.16 41.15,28.12 42.98,28.12 44.04,29.18 44.42,29.18 LCD.1
  Bottom 0.152: RTC.2 22.86,3.43 22.63,3.66 22.63,3.81 22.25,4.19 22.25,13.41 23.47,14.63 30.86,14.63 32.23,16 33.76,16 35.05,17.3 35.05,21.34 36.65,22.94 36.65,23.32 36.8,23.47 36.8,24.08 ATMEGA328.28
SDA
  Top 0.152: ATMEGA328.27 34.29,23.77 35.62,22.44 | 35.62,22.44 35.66,22.4 37.26,22.4 37.64,22.78 38.56,22.78 41.38,25.6 42.98,25.6 44.04,26.67 LCD.2 | 35.62,22.44 35.05,21.87 35.05,17.3 33.68,15.93 28.12,15.93 26.82,14.63 23.47,14.63 22.25,13.41 22.25,6.02 25.38,2.9 25.38,2.59 RTC.1
VCCA  (via drill 0.35)
  Top 0.406: RAMB10K.P$2 16.54,20.27 16.54,19.66 17.53,18.67 17.53,18.21 17.6,18.14 16.54,17.07 16.54,16.54 RACT10K.P$1 16.61,16.38 16.61,15.77 18.52,13.87 18.52,4.95 20.27,3.2 20.27,2.59 RTC.3 | SPI.2 14.02,20.27 14.78,20.27 14.86,20.19 15.32,20.19 15.39,20.12 15.47,20.12 15.54,20.19 16.38,20.19 RAMB10K.P$2 | TPVREG.P$1 25.38,43.13 25.38,42.98 24.08,41.68 21.95,41.68 20.95,40.69 20.34,40.69 RPU30-60K.P$2 | 17.83,25.38 17.68,25.38 16.92,24.61 16.92,24.54 ATMEGA328.20 16.61,24 16.61,23.55 17.53,22.63 17.53,22.02 17.6,21.95 16.61,20.95 16.61,20.5 RAMB10K.P$2 | 17.83,25.38 19.05,24.16 ATMEGA328.21 | ATMEGA328.7 21.57,31.7 17.91,28.04 17.91,25.53 17.83,25.38 | v40.01,23.32 42.22,23.32 43.89,21.64 44.42,21.64 LCD.4
  Bottom 0.406: 17.14,38.1 U2.3 | 17.14,38.1 19.66,40.62 20.27,40.62 RPU30-60K.P$2 | v40.01,23.32 40.01,23.55 36.04,27.51 25.76,27.51 21.57,31.7 ATMEGA328.7 21.49,31.93 17.22,36.2 17.22,37.95 17.14,38.1

### Text on the board
tNames: GND / BAT / REG / DIV | Timelapse / v 2018 Feb 15 / Mark Fickett